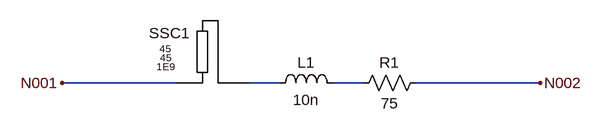
[diagram p0: schematic ElementosSerie.asc]
ElementosSerie.asc, the LTspice schematic file:
Version 4
SHEET 1 880 680
WIRE 192 112 16 112
WIRE 352 112 304 112
WIRE 480 112 432 112
WIRE 752 112 560 112
FLAG 752 112 N002
FLAG 16 112 N001
SYMBOL SSC 256 64 R0
SYMATTR SpiceModel 45
SYMATTR Value 45
SYMATTR Value2 1E9
SYMATTR InstName SSC1
SYMBOL ind 336 128 R270
WINDOW 0 32 56 VTop 2
WINDOW 3 5 56 VBottom 2
SYMATTR InstName L1
SYMATTR Value 10n
SYMBOL res 464 128 R270
WINDOW 0 32 56 VTop 2
WINDOW 3 0 56 VBottom 2
SYMATTR InstName R1
SYMATTR Value 75

The netlist it stands for:
* ElementosSerie.asc
SSC1 N001 N003 45 45 1E9
L1 N003 N004 10n
R1 N004 N002 75
.backanno
.end